# EAGLE schematic SubHarmonics Main Board v3 (EAGLE 9.6.2)
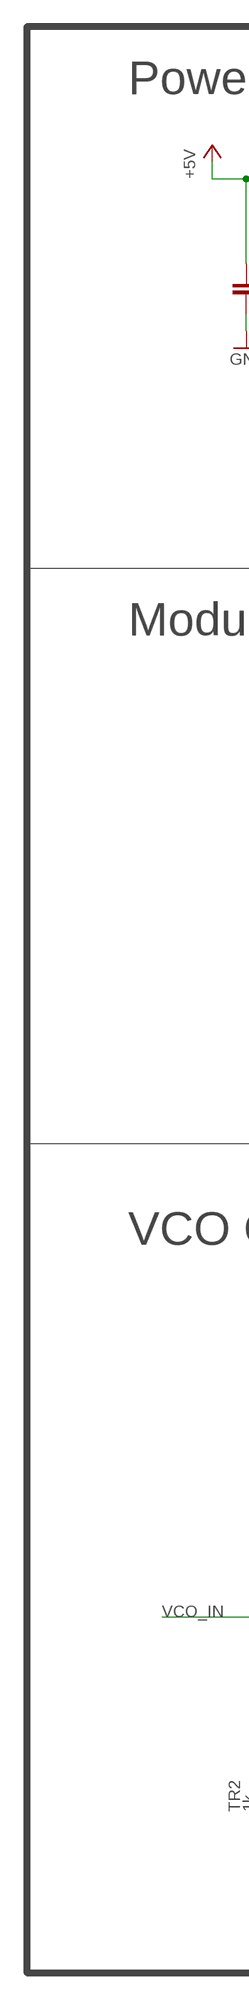
[diagram p0: schematic, sheet 1, part 1 of 2]
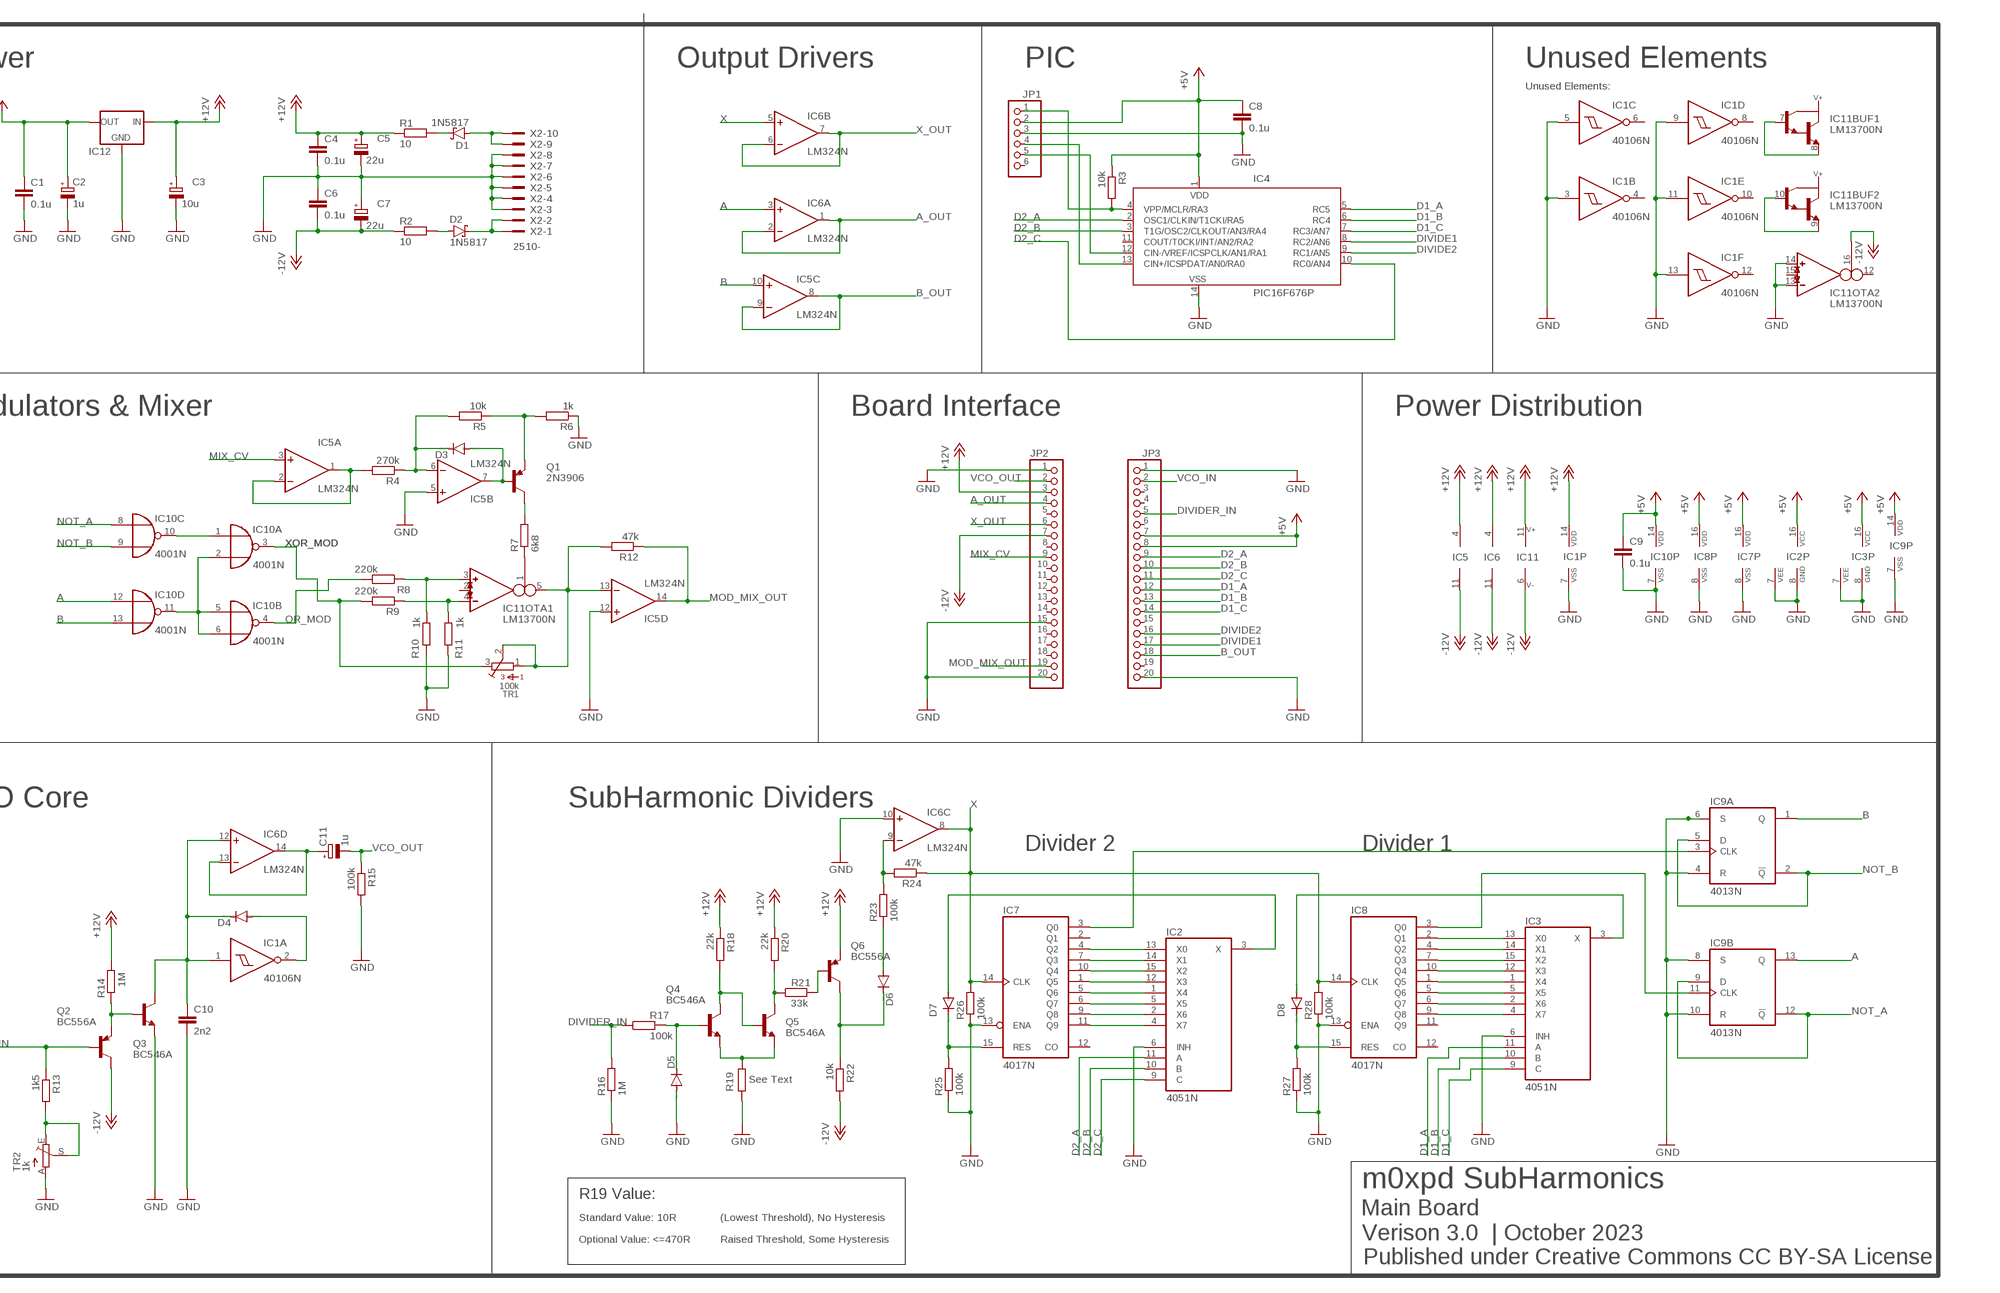
[diagram p1: schematic, sheet 1, part 2 of 2]

## Parts
C1  0.1u  C-EU050-025X075  [C050-025X075]
C2  1u  CPOL-EUE2.5-5  [E2,5-5]
C3  10u  CPOL-EUE2.5-5  [E2,5-5]
C4  0.1u  C-EU050-025X075  [C050-025X075]
C5  22u  CPOL-EUE2.5-5  [E2,5-5]
C6  0.1u  C-EU050-025X075  [C050-025X075]
C7  22u  CPOL-EUE2.5-5  [E2,5-5]
C8  0.1u  C-EU050-025X075  [C050-025X075]
C9  0.1u  C-EU050-025X075  [C050-025X075]
C10  2n2  C-EU050-030X075  [C050-030X075]
C11  1u  CPOL-EUE2.5-5  [E2,5-5]
D1  1N5817  SCHOTTKY-DIODEDO35-7  [DO35-7]
D2  1N5817  SCHOTTKY-DIODEDO35-7  [DO35-7]
D3  1N4148DO35-7  [DO35-7]
D4  1N4148DO35-7  [DO35-7]
D5  1N4148DO35-7  [DO35-7]
D6  1N4148DO35-7  [DO35-7]
D7  1N4148DO35-7  [DO35-7]
D8  1N4148DO35-7  [DO35-7]
IC1  40106N  [DIL14]
IC2  4051N  [DIL16]
IC3  4051N  [DIL16]
IC4  PIC16F676P  [DIL14]
IC5  LM324N  [DIL14]
IC6  LM324N  [DIL14]
IC7  4017N  [DIL16]
IC8  4017N  [DIL16]
IC9  4013N  [DIL14]
IC10  4001N  [DIL14]
IC11  LM13700N  [DIL16]
IC12  78LXX  [78LXX]
JP1  PINHD-1X6  [1X06]
JP2  PINHD-1X20  [1X20]
JP3  PINHD-1X20  [1X20]
Q1  2N3906  [TO92]
Q2  BC556A  [TO92-EBC]
Q3  BC546A  [TO92-EBC]
Q4  BC546A  [TO92-EBC]
Q5  BC546A  [TO92-EBC]
Q6  BC556A  BC556  [TO92-EBC]
R1  10  R-EU_0204/7  [0204/7]
R2  10  R-EU_0204/7  [0204/7]
R3  10k  R-EU_0204/7  [0204/7]
R4  270k  R-EU_0204/7  [0204/7]
R5  10k  R-EU_0204/7  [0204/7]
R6  1k  R-EU_0204/7  [0204/7]
R7  6k8  R-EU_0204/7  [0204/7]
R8  220k  R-EU_0204/7  [0204/7]
R9  220k  R-EU_0204/7  [0204/7]
R10  1k  R-EU_0204/7  [0204/7]
R11  1k  R-EU_0204/7  [0204/7]
R12  47k  R-EU_0204/7  [0204/7]
R13  1k5  R-EU_0204/7  [0204/7]
R14  1M  R-EU_0204/7  [0204/7]
R15  100k  R-EU_0204/7  [0204/7]
R16  1M  R-EU_0204/7  [0204/7]
R17  100k  R-EU_0204/7  [0204/7]
R18  22k  R-EU_0204/7  [0204/7]
R19  See Text  R-EU_0204/7  [0204/7]
R20  22k  R-EU_0204/7  [0204/7]
R21  33k  R-EU_0204/7  [0204/7]
R22  10k  R-EU_0204/7  [0204/7]
R23  100k  R-EU_0204/7  [0204/7]
R24  47k  R-EU_0204/7  [0204/7]
R25  100k  R-EU_0204/7  [0204/7]
R26  100k  R-EU_0204/7  [0204/7]
R27  100k  R-EU_0204/7  [0204/7]
R28  100k  R-EU_0204/7  [0204/7]
TR1  100k  BOURNS_3362P_TRIMMERP  [BOURNS_3362P_TRIMMER]
TR2  1k  TRIM_EU-B64Y  [B64Y]
X2  2510-  [PAK100/2500-10]

## Nets
+5V: C1.1 C2.+ C8.1 C9.1 IC2.16(VCC) IC3.16(VCC) IC4.1(VDD) IC7.16(VDD) IC8.16(VDD) IC9.14(P:VDD) IC10.14(P:VDD) IC12.OUT JP1.2 JP3.7 JP3.8 R3.1
+12V: C3.+ C4.1 C5.+ IC1.14(P:VDD) IC5.4(P:V+) IC6.4(P:V+) IC11.11(SUPPLY:V+) IC12.IN JP2.3 Q6.E R1.1 R14.2 R18.1 R20.1
-12V: C6.2 C7.- IC5.11(P:V-) IC6.11(P:V-) IC11.6(SUPPLY:V-) IC11.16(OTA2:I_BIAS) JP2.7 Q2.C R2.1 R22.2
A: IC6.3(A:+IN) IC9.13(B:Q) IC10.12(D:I0)
A_OUT: IC6.1(A:OUT) IC6.2(A:-IN) JP2.4
B: IC5.10(C:+IN) IC9.1(A:Q) IC10.13(D:I1)
B_OUT: IC5.8(C:OUT) IC5.9(C:-IN) JP3.18
D1_A: IC3.11(A) IC4.5(RC5) JP3.12
D1_B: IC3.10(B) IC4.6(RC4) JP3.13
D1_C: IC3.9(C) IC4.7(RC3/AN7) JP3.14
D2_A: IC2.11(A) IC4.2(OSC1/CLKIN/T1CKI/RA5) JP3.9
D2_B: IC2.10(B) IC4.3(T1G/OSC2/CLKOUT/AN3/RA4) JP3.10
D2_C: IC2.9(C) IC4.10(RC0/AN4) JP3.11
DIVIDE1: IC4.8(RC2/AN6) JP3.17
DIVIDE2: IC4.9(RC1/AN5) JP3.16
DIVIDER_IN: JP3.5 R16.2 R17.1
GND: C1.2 C2.- C3.- C4.2 C5.- C6.1 C7.+ C8.2 C9.2 C10.2 D5.A IC1.3(B:I) IC1.5(C:I) IC1.7(P:VSS) IC1.9(D:I) IC1.11(E:I) IC1.13(F:I) IC2.6(INH) IC2.7(VEE) IC2.8(GND) IC3.6(INH) IC3.7(VEE) IC3.8(GND) IC4.14(VSS) IC5.5(B:+IN) IC5.12(D:+IN) IC6.10(C:+IN) IC7.8(VSS) IC7.13(ENA) IC8.8(VSS) IC8.13(ENA) IC9.4(A:R) IC9.6(A:S) IC9.7(P:VSS) IC9.8(B:S) IC9.10(B:R) IC10.7(P:VSS) IC11.13(OTA2:IN_N) IC11.14(OTA2:IN_P) IC12.GND JP1.3 JP2.1 JP2.15 JP2.20 JP3.1 JP3.20 Q3.E R6.1 R10.2 R11.2 R15.2 R16.1 R19.2 R25.1 R26.1 R27.1 R28.1 TR2.A X2.3 X2.4 X2.5 X2.6 X2.7 X2.8
MIX_CV: IC5.3(A:+IN) JP2.9
MOD_MIX_OUT: IC5.14(D:OUT) JP2.19 R12.1
N$1: IC2.2(X6) IC7.9(Q8)
N$2: IC5.1(A:OUT) IC5.2(A:-IN) R4.2
N$3: D7.C IC7.15(RES) R25.2
N$4: D7.A IC2.3(X)
N$5: IC2.13(X0) IC7.4(Q2)
N$6: IC2.14(X1) IC7.7(Q3)
N$7: IC2.15(X2) IC7.10(Q4)
N$8: IC2.12(X3) IC7.1(Q5)
N$9: IC2.1(X4) IC7.5(Q6)
N$10: IC2.5(X5) IC7.6(Q7)
N$11: IC2.4(X7) IC7.11(Q9)
N$12: IC11.3(OTA1:IN_P) R8.1 R10.1
N$13: D1.A X2.9 X2.10
N$14: D1.C R1.2
N$15: IC4.4(VPP/MCLR/RA3) JP1.1 R3.2
N$16: D8.C IC8.15(RES) R27.2
N$17: D8.A IC3.3(X)
N$18: IC11.7(BUF1:B) IC11.8(BUF1:E)
N$19: IC3.14(X1) IC8.4(Q2)
N$20: IC3.15(X2) IC8.7(Q3)
N$21: IC3.12(X3) IC8.10(Q4)
N$22: IC3.1(X4) IC8.1(Q5)
N$23: IC3.5(X5) IC8.5(Q6)
N$24: IC3.2(X6) IC8.6(Q7)
N$25: IC3.4(X7) IC8.9(Q8)
N$26: IC11.4(OTA1:IN_N) R9.1 R11.1
N$27: D2.A R2.2
N$28: D2.C X2.1 X2.2
N$29: IC11.9(BUF2:E) IC11.10(BUF2:B)
N$30: IC11.1(OTA1:I_BIAS) R7.1
N$31: IC4.13(CIN+/ICSPDAT/AN0/RA0) JP1.4
N$32: IC4.12(CIN-/VREF/ICSPCLK/AN1/RA1) JP1.5
N$33: IC3.13(X0) IC8.2(Q1)
N$34: IC8.3(Q0) IC9.11(B:CLK)
N$35: IC7.3(Q0) IC9.3(A:CLK)
N$37: R13.2 TR2.E TR2.S
N$47: D6.C Q6.C R22.1
N$48: D6.A R23.1
N$49: D4.A IC1.2(A:O)
N$50: C10.1 D4.C IC1.1(A:I) IC6.12(D:+IN) Q3.C
N$51: Q2.E Q3.B R14.1
N$52: IC6.9(C:-IN) R23.2 R24.2
N$53: C11.+ IC6.13(D:-IN) IC6.14(D:OUT)
N$55: Q4.E Q5.E R19.1
N$68: IC10.1(A:I0) IC10.10(C:O)
N$69: IC10.2(A:I1) IC10.5(B:I0) IC10.6(B:I1) IC10.11(D:O)
N$70: D5.C Q4.B R17.2
N$80: Q1.1(C) R7.2
N$84: D3.C IC5.6(B:-IN) R4.1 R5.2
N$85: Q4.C Q5.B R18.2
N$86: Q5.C R20.2 R21.1
N$87: D3.A IC5.7(B:OUT) Q1.2(B)
N$88: Q1.3(E) R5.1 R6.2
N$89: Q6.B R21.2
N$91: IC5.13(D:-IN) IC11.5(OTA1:OUT) R12.2 TR1.1 TR1.2
NOT_A: IC9.9(B:D) IC9.12(B:!Q) IC10.8(C:I0)
NOT_B: IC9.2(A:!Q) IC9.5(A:D) IC10.9(C:I1)
OR_MOD: IC10.4(B:O) R8.2
VCO_IN: JP3.2 Q2.B R13.1
VCO_OUT: C11.- JP2.2 R15.1
X: IC6.5(B:+IN) IC6.8(C:OUT) IC7.14(CLK) IC8.14(CLK) R24.1 R26.2 R28.2
X_OUT: IC6.6(B:-IN) IC6.7(B:OUT) JP2.6
XOR_MOD: IC10.3(A:O) R9.2 TR1.3
Unconnected: IC1.4(B:O) IC1.6(C:O) IC1.8(D:O) IC1.10(E:O) IC1.12(F:O) IC4.11(COUT/T0CKI/INT/AN2/RA2) IC7.2(Q1) IC7.12(CO) IC8.11(Q9) IC8.12(CO) IC11.2(OTA1:I_DIODE) IC11.12(OTA2:OUT) IC11.15(OTA2:I_DIODE) JP1.6 JP2.5 JP2.8 JP2.10 JP2.11 JP2.12 JP2.13 JP2.14 JP2.16 JP2.17 JP2.18 JP3.3 JP3.4 JP3.6 JP3.15 JP3.19

## Notes on the sheet
- Power | Output Drivers | PIC | Unused Elements
- Unused Elements:
- Modulators & Mixer | Board Interface | Power Distribution
- IC5 | IC6 | IC11
- VCO Core | SubHarmonic Dividers
- Divider 2 | Divider 1
- m0xpd SubHarmonics
- R19 Value:
- Main Board
- Standard Value: 10R | (Lowest Threshold), No Hysteresis
- Optional Value: <=470R | Raised Threshold, Some Hysteresis | Verison 3.0  | October 2023
- Published under Creative Commons CC BY-SA License

## Library data of the parts
C1 C4 C6 C8-C10 = rcl:C-EU: CAPACITOR, European symbol; SPICEPREFIX: C
C2 C3 C5 C7 C11 = rcl:CPOL-EU: POLARIZED CAPACITOR, European symbol; SPICEPREFIX: C
D1 D2 = diode:SCHOTTKY-DIODE: Schottky Diode
D3-D8 = diode:1N4148: DIODE high speed (Philips)
IC1 = 40xx:40106: Hex SCHMITT TRIGGER
IC2 IC3 = 40xx:4051: 8-channel ANALOG MULTIPLEXER
IC4 = microchip:PIC16F676: 14-Pin, Flash-Based 8-Bit CMOS Microcontroller High Performance RISC CPU: * Only 35 instructions to learn - All single-cycle instructions except branches * Operating speed: - DC - 20 MHz oscillator/clock input - DC - 200 ns instruction cycle * Internal and external oscillator options - Precision Internal 4 MHz oscillator factory calibrated to ±1% - External Oscillator support for crystals and resonators - 5?s wake-up from SLEEP, 3.0V, typical * Power saving SLEEP mode * Wide operating voltage range - 2.0V to 5.5V * Industrial and Extended temperature range * Low power Power-on Reset (POR) * Power-up Timer (PWRT) and Oscillator Start-up Timer (OST) * Brown-out Detect (BOD) * Watchdog Timer (WDT) with independent oscillator for reliable operation * Multiplexed MCLR/Input-pin * Interrupt-on-pin change * Individual programmable weak pull-ups * Programmable code protection * High Endurance FLASH/EEPROM Cell - 100,000 write FLASH endurance - 1,000,000 write EEPROM endurance - FLASH/Data EEPROM Retention: > 40 years * Standby Current: - 1 nA @ 2.0V, typical * Operating Current: - 8.5?A @ 32 kHz, 2.0V, typical - 100?A @ 1 MHz, 2.0V, typical * Watchdog Timer Current - 300 nA @ 2.0V, typical * Timer1 oscillator current: - 4?A @ 32 kHz, 2.0V, typical * 12 I/O pins with individual direction control * High current sink/source for direct LED drive * Analog-to-Digital Converter module (PIC16F676): - 10-bit resolution - Programmable 8-channel input - Voltage reference input * In-Circuit Serial ProgrammingTM (ICSPTM) via two pins Source: http://ww1.microchip.com/downloads/en/DeviceDoc/40039E.pdf; MF: MICROCHIP; MPN: PIC16F676-I/P; OC_FARNELL: 9760512; OC_NEWARK: 54K2829
IC5 IC6 = linear:LM324: OP AMP
IC7 IC8 = 40xx:4017: COUNTER/DIVIDER
IC9 = 40xx:4013: Dual D FLIP FLOP, set/reset
IC10 = 40xx:4001: Quad 2-input NOR
IC11 = ota:LM13700: Dual OTA with buffers
IC12 = v-reg:78LXX: VOLTAGE REGULATOR
JP1 = pinhead:PINHD-1X6: PIN HEADER
JP2 JP3 = pinhead:PINHD-1X20: PIN HEADER
Q1 = transistor-pnp:2N3906: PNP Transistor
Q2 Q6 = transistor-pnp:BC556*: PNP Transistror
Q3-Q5 = transistor-npn:BC546*: NPN Transistor
R1-R28 = rcl:R-EU_: RESISTOR, European symbol; SPICEPREFIX: R
TR1 = MusicThingModular:BOURNS_3362P_TRIMMER: 3362 Series 1/4" Square Trimmer
TR2 = pot:TRIM_EU-: POTENTIOMETER
X2 = con-3m:2510-: 3M (TM) Pak 100 4-Wall Header Source: 3M; MF: 3M; MPN: 2510-6002UB; OC_FARNELL: 9838244; OC_NEWARK: 46F4725